# EasyEDA Pro project ProPrj_ESP32SoundBoard_2026-02-01.epro, board ESP32SoundBoard
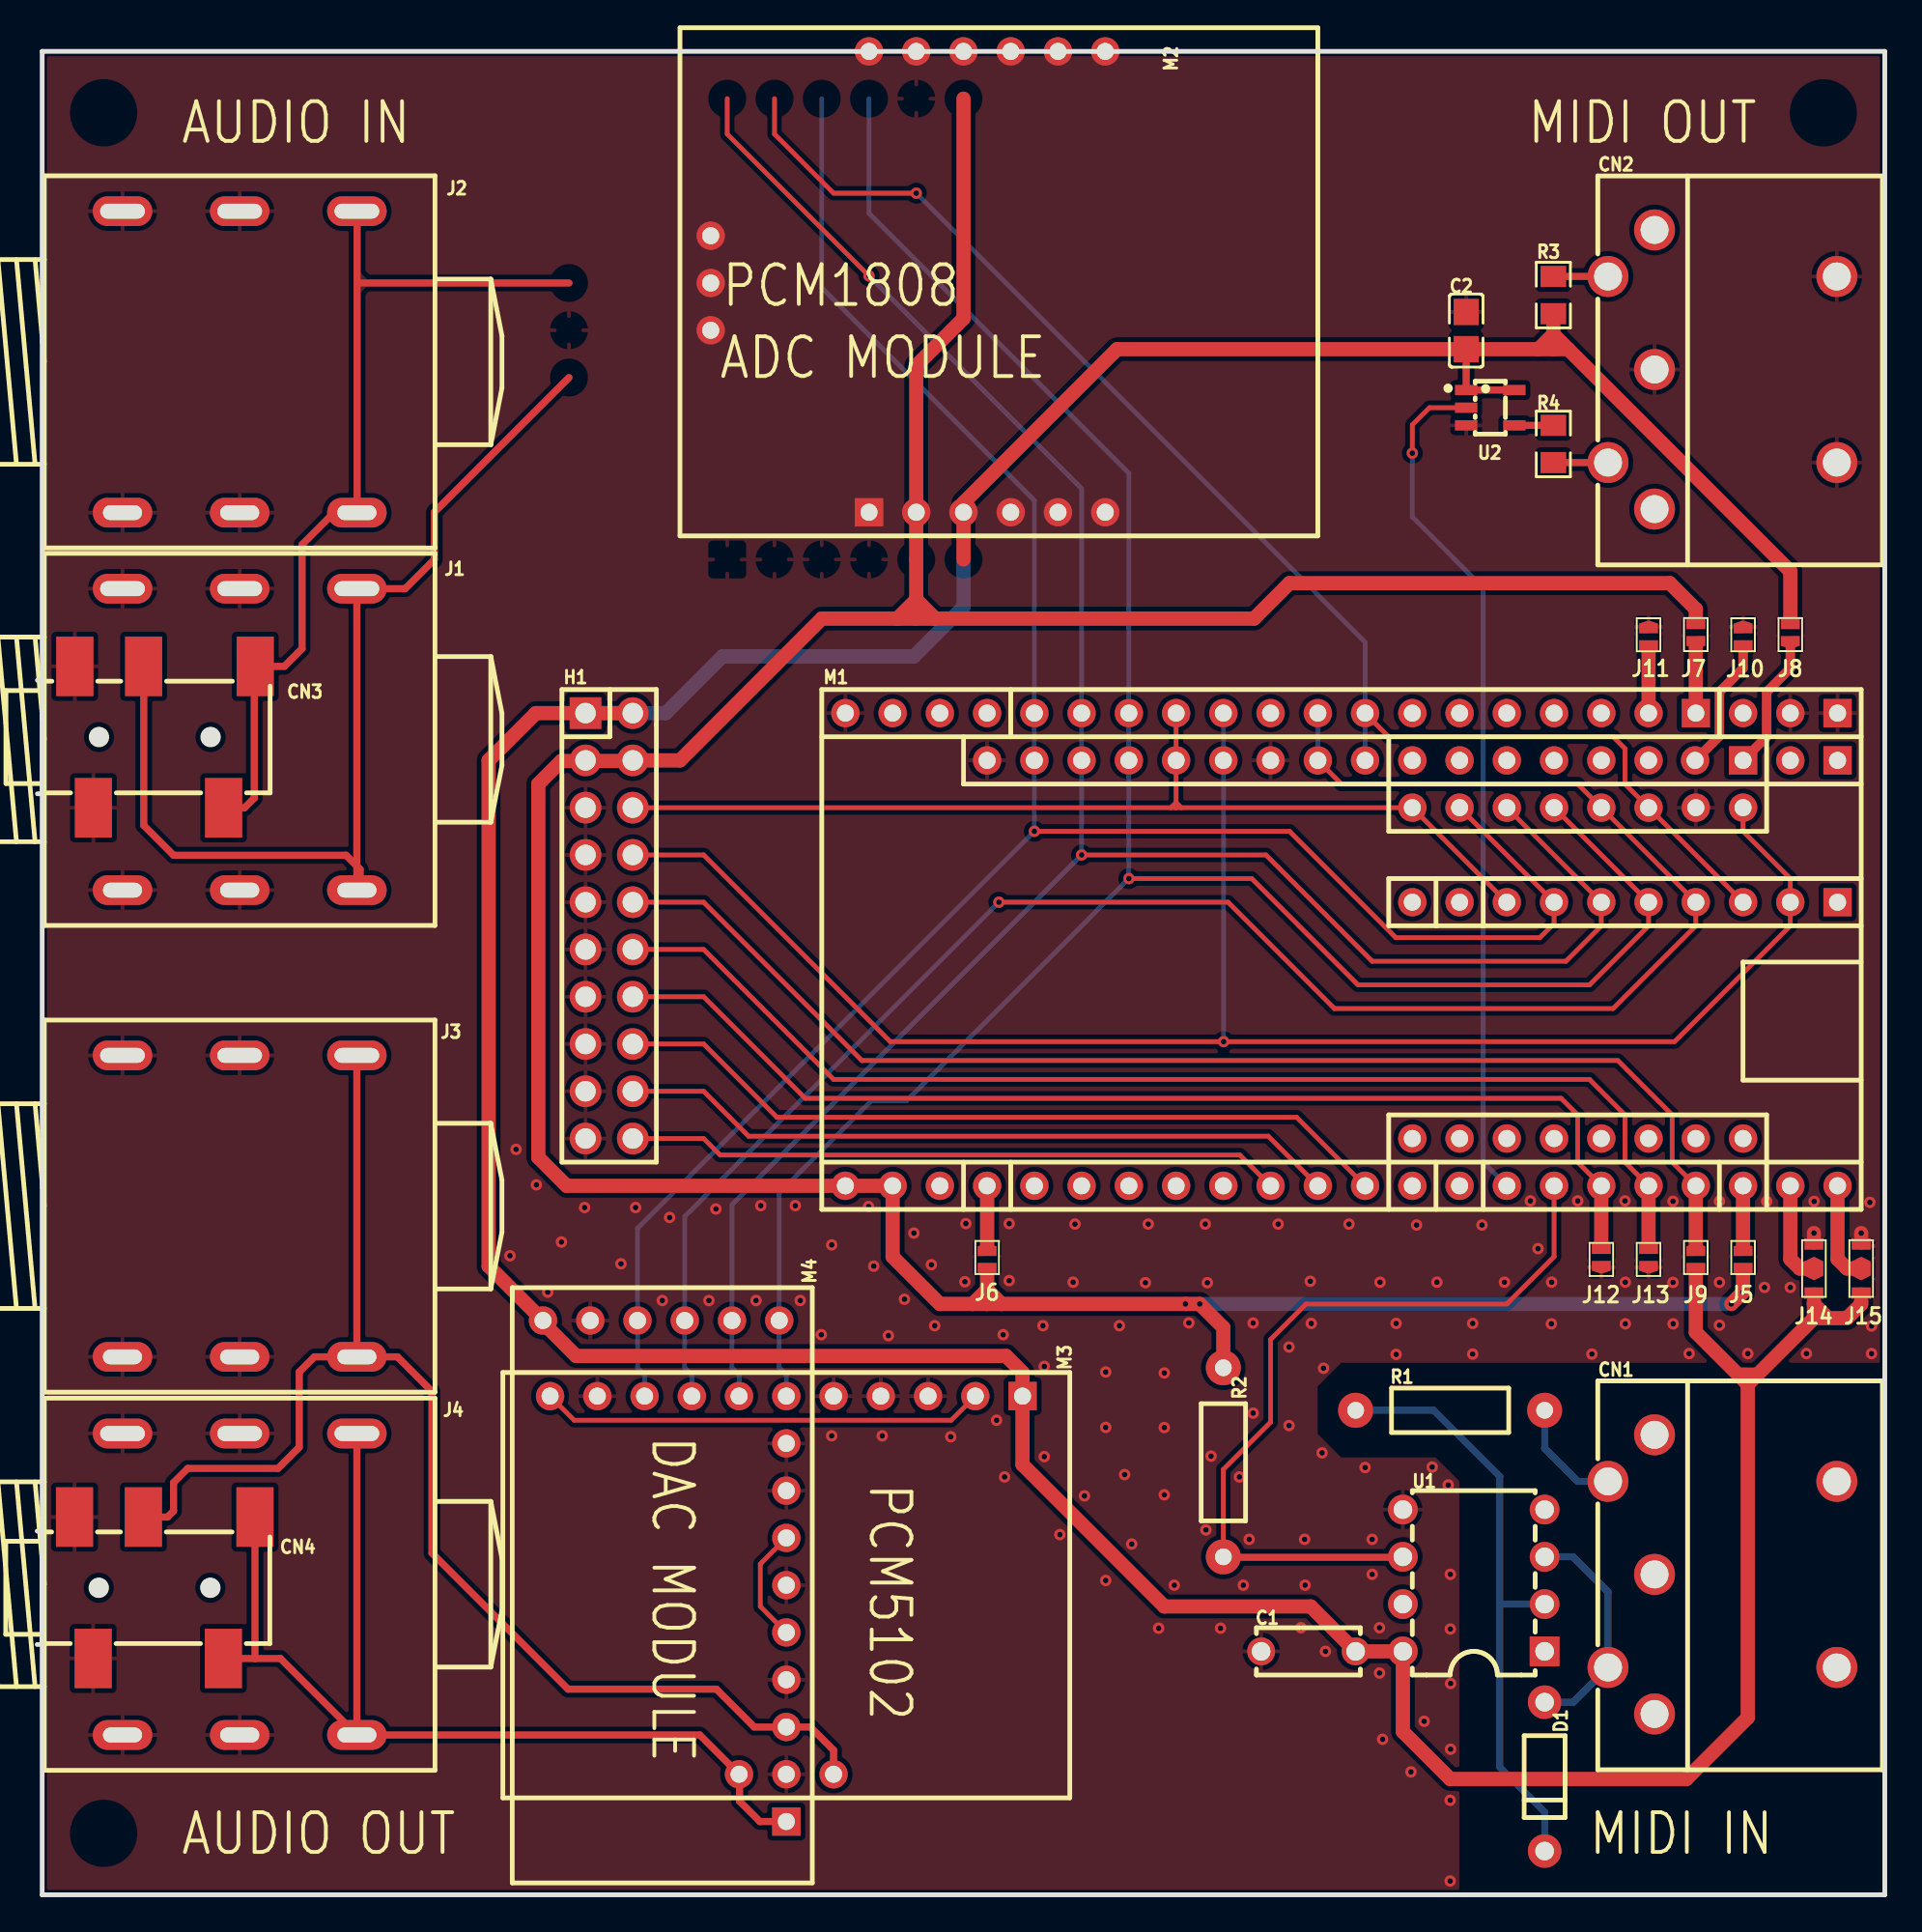
[diagram p4: board, top side]
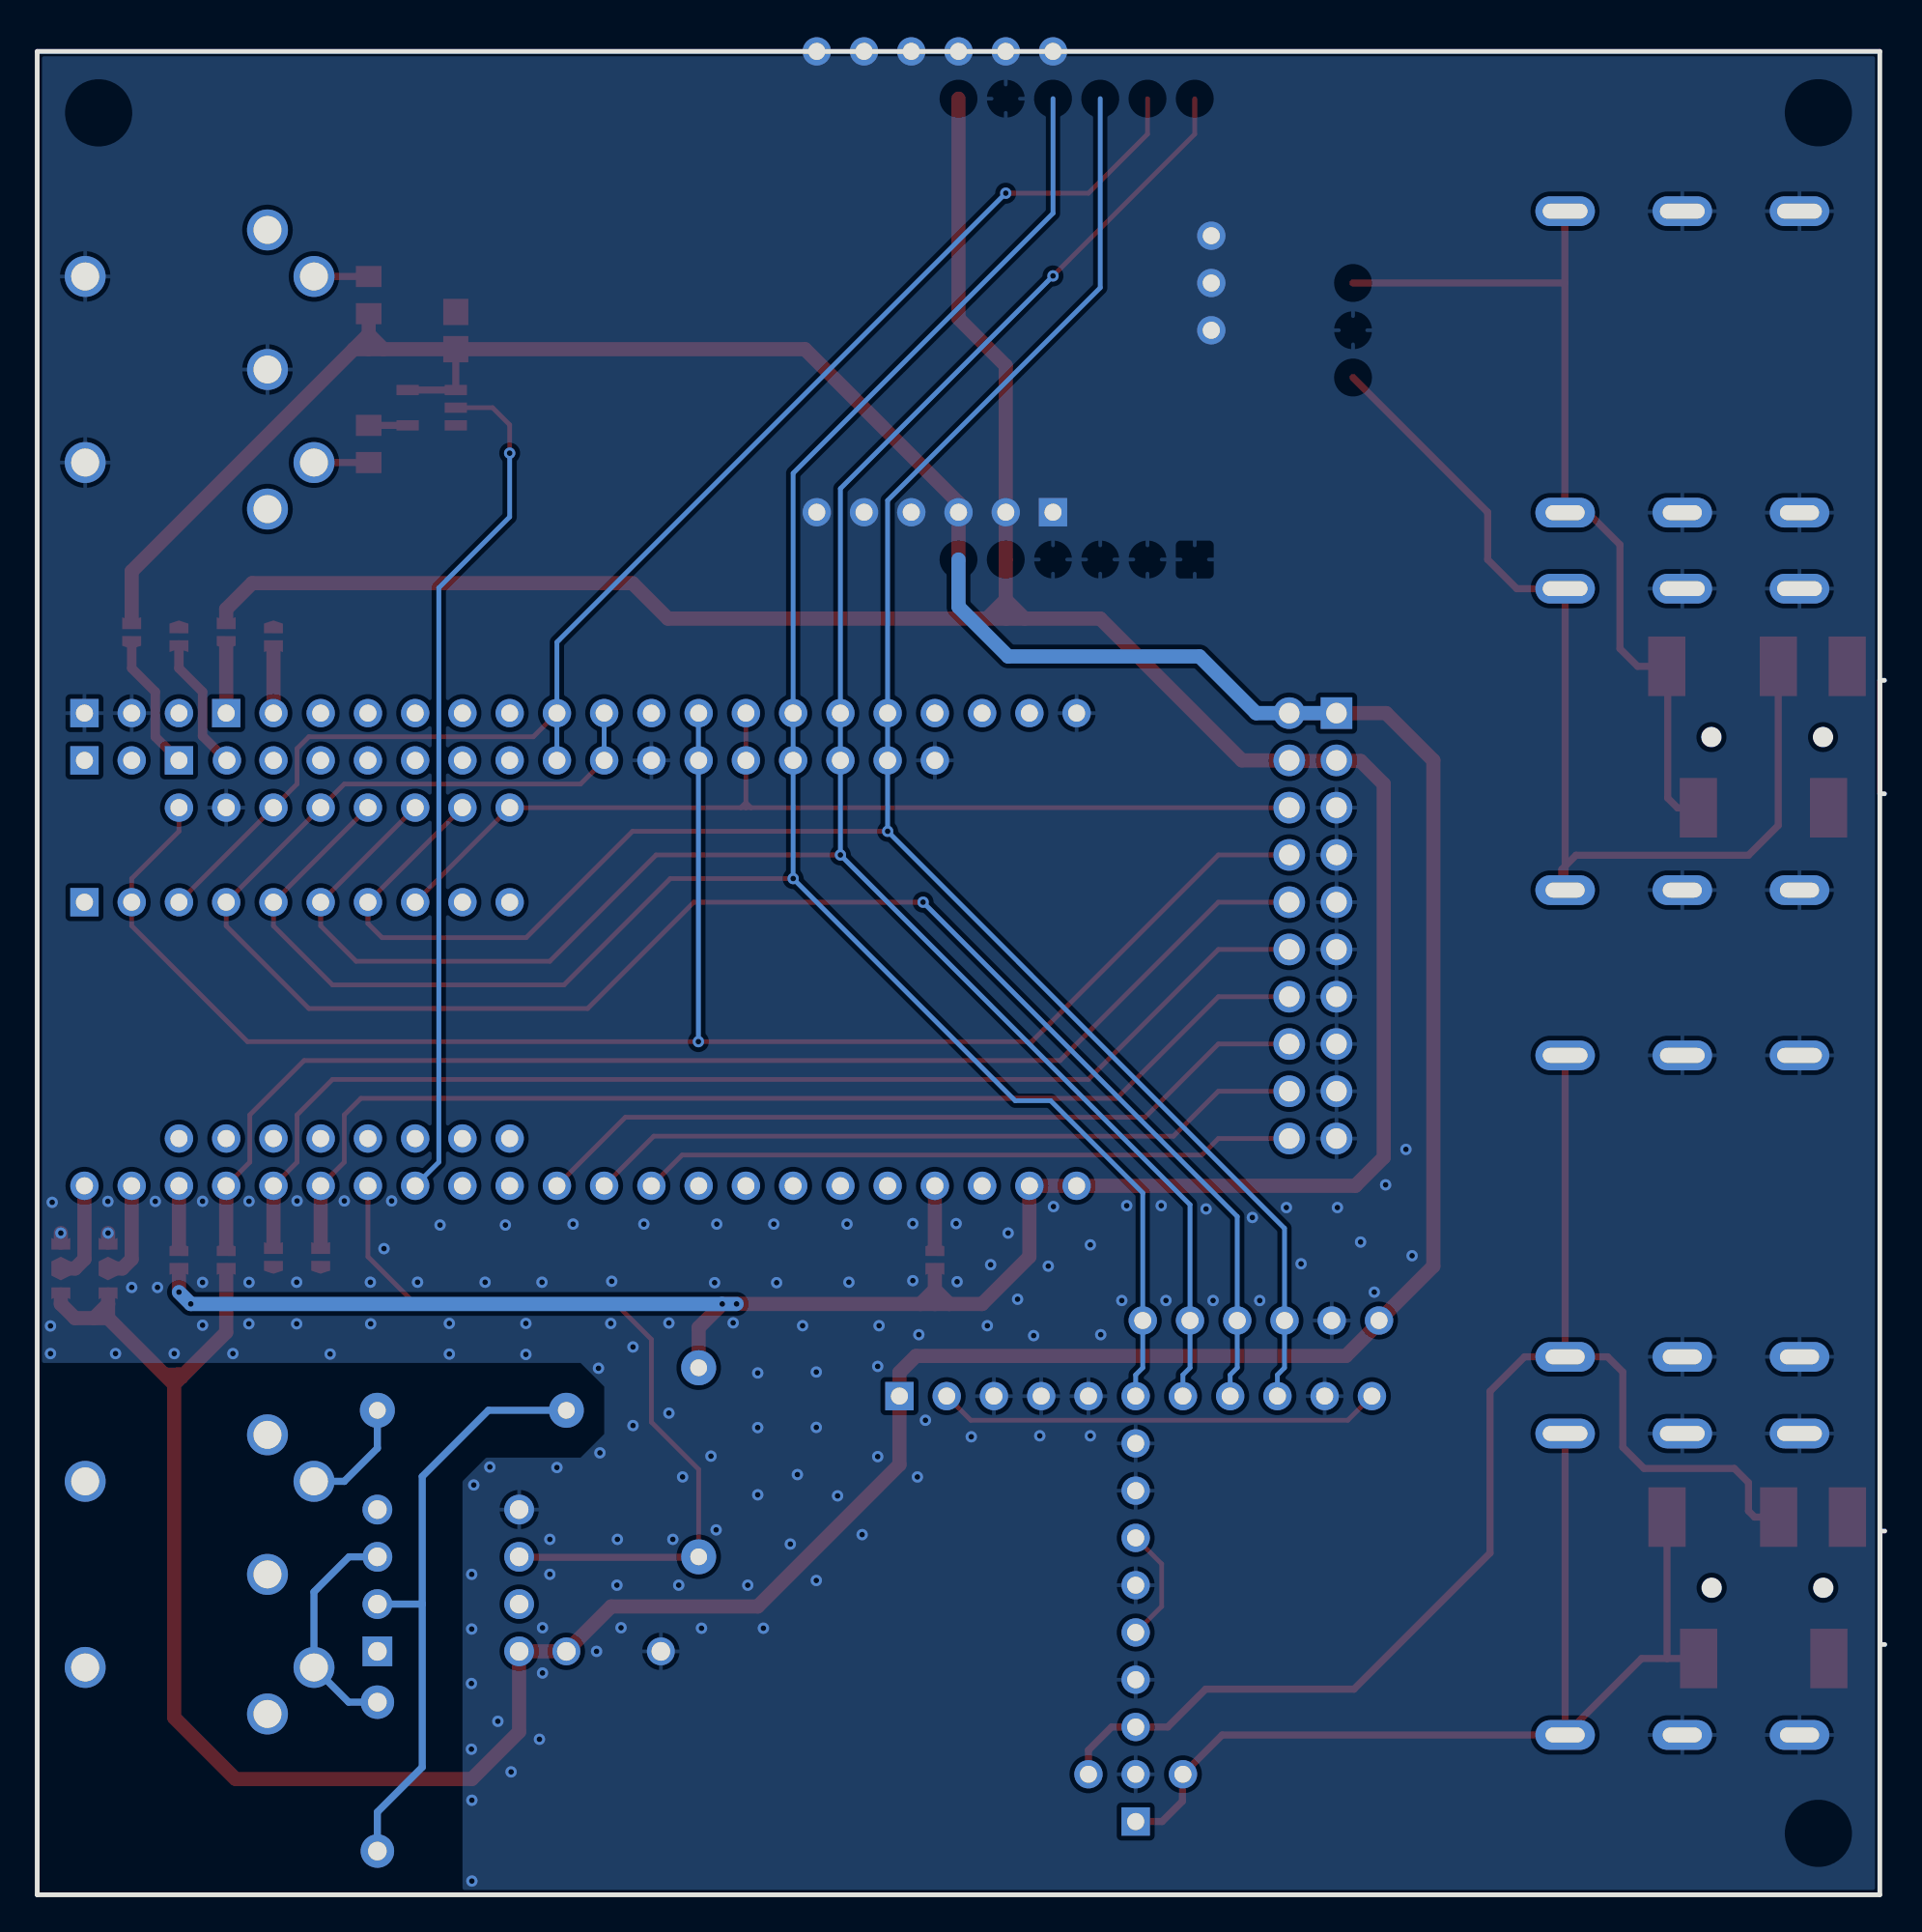
[diagram p5: board, bottom side, seen from below]

Outline 99.33 x 99.06 mm; copper layers: Top Layer, Bottom Layer. Coordinates in mm from the lower left corner of the outline.
Outline path: 0.27,99.06 99.33,99.06 99.33,0 0.27,0 0.27,99.06
Stack: Top Layer 0.035mm / Dielectric1 1.51mm FR4 er 4.5 / Bottom Layer 0.035mm

## Design rules (mm)
template: Custom Config
spacing copperThickness1oz (default): track to track 0.152, other pairs 0.152 to 0.3
spacing copperThickness2oz: track to track 0.203, other pairs 0.152 to 0.3
track width copperThickness1oz (default): min 0.127, default 0.254, max 2.54
track width copperThickness2oz: min 0.203, default 0.254, max 2.54
differential pair differentialPair (default): width min 0.127, default 0.254, max 2.54; gap min 0.152, default 0.152
via viaSize (default): diameter min 0.5, default 0.61, max 10; hole min 0.3, default 0.305, max 6.3

## Placement (name value [footprint] x y rotation side)
C1  100nF  [CAP-TH_L5.5-W2.4-P5.08-D0.6]  68.34 13.08 0 top
C2  100nF  [C0805]  76.82 84.06 90 top
CN1  DIN-504B-M10  [CONN-TH_DIN-504B-M10]  90.6 17.22 90 top
CN2  DIN-504B-M10  [CONN-TH_DIN-504B-M10]  90.6 81.97 90 top
CN3  PJ-327A 5JJ  [AUDIO-SMD_PJ-327A5JJ]  6.87 62.22 90 top
CN4  PJ-327A 5JJ  [AUDIO-SMD_PJ-327A5JJ]  6.86 16.5 90 top
D1  1N4148  [DO-35_BD2.0-L4.0-P8.00-D0.5-FD]  81.04 6.35 270 top
H1  -  [HDR-TH_20P-P2.54-V-M-R2-C10-S2.54]  30.75 52.07 270 top
J1  PJ-609  [AUDIO-TH_PJ-609]  10.89 62.09 0 top
J2  PJ-609  [AUDIO-TH_PJ-609]  10.89 82.37 0 top
J3  PJ-609  [AUDIO-TH_PJ-609]  10.89 37.01 0 top
J4  PJ-609  [AUDIO-TH_PJ-609]  10.89 16.69 0 top
J5  -  [Solder jumper]  91.71 33.7 90 top
J6  -  [Solder jumper]  51.07 33.7 90 top
J7  -  [Solder jumper]  89.17 68.27 270 top
J8  -  [Solder jumper]  94.25 68.27 270 top
J9  -  [Solder jumper]  89.17 33.7 90 top
J10  -  [Solder jumper]  91.71 67.16 90 top
J11  -  [Solder jumper]  86.63 67.16 90 top
J12  -  [Solder jumper]  84.09 34.69 270 top
J13  -  [Solder jumper]  86.63 34.69 270 top
J14  -  [Solder jumper 3 way]  95.52 33.66 90 top
J15  -  [Solder jumper 3 way]  98.06 33.66 90 top
M1  -  [ESP32_DEV_BOARD_MIX]  96.79 63.5 270 top
M2  PCM1808  [PCM1808_ADC_MODULE]  37.1 71.75 90 top
M3  PCM5102  [WCMCU-5102]  52.97 26.8 270 top
M4  PCM5102  [PCM5102_MODULE]  40.27 3.94 180 top
R1  10kΩ  [R_AXIAL-0.4]  75.96 26.03 0 top
R2  10kΩ  [R_AXIAL-0.4]  63.77 23.24 90 top
R3  10kΩ  [R0805]  81.51 85.96 90 top
R4  10kΩ  [R0805]  81.51 77.96 270 top
U1  6N139  [DIP-8_L9.6-W6.4-P2.54-LS7.9-BL]  77.23 16.89 90 top
U2  74LVC1G126GV  [SOT-753_L3.1-W1.7-P0.95-LS3.0-BR]  78.12 79.91 180 top

## Footprints (pads in the part's own frame, mm; a bottom-side part is the same pattern mirrored in y, then rotated)
AUDIO-SMD_PJ-327A5JJ
  rect 3.2x2 smd: 1(3.8,4.85) 2(-3.8,3.85) 3(3.8,1.15) 4(-3.8,-3.15) 5(3.8,-4.85)
AUDIO-TH_PJ-609
  oval 3.2x1.6 hole 2.1x0.8: 2(-6.3,-8.1) 4(0,-8.1) 6(6.3,-8.1)
  oval 3.2x1.6 hole 2.4x0.8: 3(-6.3,8.1) 5(0,8.1) 7(6.3,8.1)
C0805
  rect 1.41x1.35 smd: 1(-1,0) 2(1,0)
CAP-TH_L5.5-W2.4-P5.08-D0.6
  round 1.5 hole 1: 1(-2.54,0) 2(2.54,0)
CONN-TH_DIN-504B-M10
  round 2.2 hole 1.5: 1(-7.5,3.65) 2(-5,6.15) 3(0,3.65) 4(5,6.15) 5(7.5,3.65) 6(-5,-6.15) 7(5,-6.15)
DIP-8_L9.6-W6.4-P2.54-LS7.9-BL
  rect 1.6x1.6 hole 1: 1(-3.81,-3.81)
  round 1.6 hole 1: 2(-1.27,-3.81) 3(1.27,-3.81) 4(3.81,-3.81) 5(3.81,3.81) 6(1.27,3.81) 7(-1.27,3.81) 8(-3.81,3.81)
DO-35_BD2.0-L4.0-P8.00-D0.5-FD
  round 1.8 hole 1: 1(-4,0) 2(4,0)
ESP32_DEV_BOARD_MIX
  rect 1.524x1.524 hole 0.914: 1(0,0) 4(0,-7.62) 45(2.54,0) 47(2.54,-5.08) 72(10.16,0)
  round 1.524 hole 0.914: 2(0,-2.54) 3(0,-5.08) 5(0,-10.16) 6(0,-12.7) 7(0,-15.24) 8(0,-17.78) 9(0,-20.32) 10(0,-22.86) 11(0,-25.4) 12(0,-27.94) 13(0,-30.48) 14(0,-33.02) 15(0,-35.56) 16(0,-38.1) 17(0,-40.64) 18(0,-43.18) 19(0,-45.72) 20(0,-48.26) 21(0,-50.8) 22(0,-53.34) 23(25.4,-53.34) 24(25.4,-50.8) 25(25.4,-48.26) 26(25.4,-45.72) 27(25.4,-43.18) 28(25.4,-40.64) 29(25.4,-38.1) 30(25.4,-35.56) 31(25.4,-33.02) 32(25.4,-30.48) 33(25.4,-27.94) 34(25.4,-25.4) 35(25.4,-22.86) 36(25.4,-20.32) 37(25.4,-17.78) 38(25.4,-15.24) 39(25.4,-12.7) 40(25.4,-10.16) 41(25.4,-7.62) 42(25.4,-5.08) 43(25.4,-2.54) 44(25.4,0) 46(2.54,-2.54) 48(2.54,-7.66) 49(2.54,-10.16) 50(2.54,-12.7) 51(2.54,-15.24) 52(2.54,-17.78) 53(2.54,-20.32) 54(2.54,-22.86) 55(2.54,-25.4) 56(2.54,-27.94) 57(2.54,-30.48) 58(2.54,-33.02) 59(2.54,-35.56) 60(2.54,-38.1) 61(2.54,-40.64) 62(2.54,-43.18) 63(2.54,-45.72) 64(5.08,-5.08) 65(5.08,-7.62) 66(5.08,-10.16) 67(5.08,-12.7) 68(5.08,-15.24) 69(5.08,-17.78) 70(5.08,-20.32) 71(5.08,-22.86) 73(10.16,-2.54) 74(10.16,-5.08) 75(10.16,-7.62) 76(10.16,-10.16) 77(10.16,-12.7) 78(10.16,-15.24) 79(10.16,-17.78) 80(10.16,-20.32) 81(10.16,-22.86) 82(22.86,-22.86) 83(22.86,-20.32) 84(22.86,-17.78) 85(22.86,-15.24) 86(22.86,-12.7) 87(22.86,-10.16) 88(22.86,-7.62) 89(22.86,-5.08)
HDR-TH_20P-P2.54-V-M-R2-C10-S2.54
  rect 1.7x1.7 hole 1.1: 1(-11.43,-1.27)
  round 1.7 hole 1.1: 2(-11.43,1.27) 3(-8.89,-1.27) 4(-8.89,1.27) 5(-6.35,-1.27) 6(-6.35,1.27) 7(-3.81,-1.27) 8(-3.81,1.27) 9(-1.27,-1.27) 10(-1.27,1.27) 11(1.27,-1.27) 12(1.27,1.27) 13(3.81,-1.27) 14(3.81,1.27) 15(6.35,-1.27) 16(6.35,1.27) 17(8.89,-1.27) 18(8.89,1.27) 19(11.43,-1.27) 20(11.43,1.27)
PCM1808_ADC_MODULE
  rect 1.524x1.524 hole 0.914: 1(2.54,-7.62)
  round 1.524 hole 0.914: 2(2.54,-10.16) 3(2.54,-12.7) 4(2.54,-15.24) 5(2.54,-17.78) 6(2.54,-20.32) 7(27.305,-20.32) 8(27.305,-17.78) 9(27.305,-15.24) 10(27.305,-12.7) 11(27.305,-10.16) 12(27.305,-7.62) 13(17.399,0.889) 14(14.859,0.889) 15(12.319,0.889)
PCM5102_MODULE
  rect 1.524x1.524 hole 0.914: 1(0,0)
  round 1.524 hole 0.914: 3(0,-5.08) 4(0,-7.62) 5(0,-10.16) 6(0,-12.7) 7(0,-15.24) 8(0,-17.78) 9(0,-20.32) 10(0.381,-26.924) 11(2.921,-26.924) 12(5.461,-26.924) 13(8.001,-26.924) 14(10.541,-26.924) 15(13.081,-26.924)
R0805
  rect 1.133x1.377 smd: 1(-1,0) 2(1,0)
R_AXIAL-0.4
  round 1.879 hole 0.899: 1(-5.08,0) 2(5.08,0)
Solder jumper
  custom 0.635x1.016 smd: 1(0.021,0)
  custom 0.692x1.016 smd: 2(0.973,0)
Solder jumper 3 way
  custom 0.635x1.016 smd: 1(-1.206,0) 3(1.206,0)
  custom 1.27x1.016 smd: 2(0,0)
SOT-753_L3.1-W1.7-P0.95-LS3.0-BR
  rect 1.199x0.551 smd: 1(1.296,-0.95) 2(1.296,0) 3(1.296,0.95) 4(-1.296,0.95) 5(-1.296,-0.95)
WCMCU-5102
  rect 1.524x1.524 hole 0.914: 1(0,0)
  round 1.524 hole 0.914: 2(0,-2.54) 3(0,-5.08) 4(0,-7.62) 5(0,-10.16) 6(0,-12.7) 7(0,-15.24) 8(0,-17.78) 9(0,-20.32) 10(0,-22.86) 11(0,-25.4) 12(20.32,-15.24) 13(20.32,-12.7) 14(20.32,-10.16)

## Nets
As in the schematic.

Pads without a net: CN1 1 3 5 6 7; CN2 1 5; M1 3 6 7 8 9 10 13 19 20 21 25 27 28 29 30 31 35 36 45 46 49 50 51 52 53 54 72 80 81 82 83 84 85 86 87 88 89; U1 1 4 7

## Via types
v1: diameter 0.61, hole 0.305, Top Layer to Bottom Layer, 142 vias

## Routing (per net, layer and track width the routed paths; a pad name or vN(x,y) marks a point on that pad's centre or on a via; arc(x,y) is an arc through that point)
3V3: length 201.2
  Top Layer w0.762: 47.26,69.6 48.27,68.58 ; 47.26,69.6 47.26,68.61 47.23,68.58 ; 47.26,69.6 46.24,68.58 ; 47.26,69.6 47.26,82.17 49.8,84.71 49.8,96.52 ; 48.27,68.58 65.42,68.58 67.32,70.48 87.77,70.48 89.17,69.09 89.17,68.4 ; 48.27,68.58 47.23,68.58 ; 51.07,31.75 50.29,31.75 ; 51.07,31.75 51.84,31.75 ; 51.07,31.75 51.07,32.52 ; 50.29,31.75 48.53,31.75 45.99,34.29 M1.24 M1.23 28.46,38.1 26.94,39.62 26.94,59.69 28.17,60.93 31.98,60.93 H1.4 34.56,60.96 42.18,68.58 46.24,68.58 ; 50.29,31.75 51.07,32.52 ; 51.07,33.55 51.07,32.52 ; 51.07,32.52 51.84,31.75 ; 47.23,68.58 46.24,68.58 ; 63.77,28.32 63.77,30.48 v1(62.5,31.75) v1(61.73,31.75) 51.84,31.75 ; v1(91.07,31.75) v1(91.71,32.39) 91.71,33.55
  Bottom Layer w0.762: v1(61.73,31.75) v1(62.5,31.75) v1(91.07,31.75) v1(91.71,32.39)
+5V: length 251.6
  Top Layer w0.381: U2.5 U2.1 C2.1
  Top Layer w0.762: 96.28,30.99 97.3,30.99 98.06,31.75 98.06,32.26 ; 96.28,30.99 95.52,31.75 ; 96.28,30.99 95.52,30.99 ; 95.52,31.75 95.52,30.99 ; 95.52,31.75 95.52,32.26 ; 81.51,83.86 80.71,83.06 ; 81.51,83.86 R3.1 ; 81.51,83.86 82.31,83.06 ; 81.51,83.86 81.51,83.08 81.53,83.06 ; 80.71,83.06 81.53,83.06 ; 80.71,83.06 C2.1 58.05,83.06 49.8,74.8 49.8,71.75 ; 91.96,27.43 89.17,30.23 89.17,33.55 ; 91.96,27.43 91.96,9.53 88.66,6.22 75.96,6.22 73.42,8.76 U1.8 C1.2 68.47,15.49 60.59,15.49 52.97,23.11 M3.1 52.97,28.07 52.08,28.96 28.97,28.96 27.19,30.73 27.19,30.86 24.27,33.78 24.27,60.96 26.81,63.5 H1.1 H1.2 ; 91.96,27.43 95.52,30.99 ; 81.53,83.06 82.31,83.06 ; 82.31,83.06 94.25,71.12 94.25,68.4 ; 92.46,27.95 91.47,27.95
  Bottom Layer w0.762: 49.8,71.75 49.8,69.22 47.13,66.55 36.84,66.55 33.8,63.5 H1.2 H1.1
GND: length 1
  Top Layer w0.762: v1(95.52,35.56) 95.52,35.05 ; v1(98.06,35.56) 98.06,35.05
  vias: v1(25.41,34.34) v1(25.74,40.06) v1(26.84,38.15) v1(27.45,32.39) v1(28.18,35.08) v1(29.43,36.93) v1(31.38,33.91) v1(32.17,36.93) v1(33.61,31.94) v1(34,36.4) v1(36.11,31.94) v1(36.49,36.86) v1(38.65,31.94) v1(38.9,37.03) v1(40.76,37.03) v1(41.02,31.94) v1(42.15,30.1) v1(42.71,34.92) v1(42.71,24.66) v1(44.69,36.98) v1(44.97,33.78) v1(45.43,24.66) v1(45.76,30.05) v1(46.62,32) v1(47.13,35.56) v1(48.07,33.86) v1(48.25,30.58) v1(49.11,24.61) v1(49.87,32.94) v1(49.93,36.07) v1(51.58,25.5) v1(51.93,30.1) v1(52.01,22.45) v1(52.25,36.07) v1(52.25,33) v1(54.07,30.58) v1(54.14,28.4) v1(54.14,23.55) v1(54.98,19.35) v1(55.69,32.92) v1(55.79,36.04) v1(56.3,21.44) v1(57.44,28.09) v1(57.44,25.12) v1(57.44,16.89) v1(58.18,30.58) v1(58.46,22.58) v1(58.84,18.85) v1(59.58,32.89) v1(59.73,36.04) v1(60.29,14.33) v1(60.59,28.04) v1(60.59,25.11) v1(60.59,21.49) v1(61.13,16.64) v1(61.91,30.73) v1(62.79,36.04) v1(62.91,32.89) v1(62.83,19.61) v1(63.11,23.57) v1(63.62,14.33) v1(64.63,22.45) v1(64.84,16.64) v1(65.16,19.1) v1(65.37,30.72) v1(65.37,25.88) v1(66.71,36.04) v1(67.3,29.44) v1(67.3,25.22) v1(67.94,14.35) v1(68.14,19.1) v1(68.16,16.64) v1(68.44,32.97) v1(68.49,30.7) v1(69.08,23.75) v1(69.15,28.3) v1(69.26,13.08) v1(70.52,36.04) v1(71.39,22.96) v1(71.77,19.1) v1(71.77,17.22) v1(72.19,32.92) v1(72.16,14.35) v1(72.16,11.92) v1(72.33,8.36) v1(73.06,30.7) v1(73.06,29.04) v1(73.85,6.6) v1(74.16,35.99) v1(74.56,9.32) v1(75,22.99) v1(75.25,32.92) v1(75.86,22.02) v1(75.97,17.22) v1(75.97,14.28) v1(75.99,11.35) v1(75.99,7.82) v1(75.96,5.08) v1(75.96,0.74) v1(77.17,30.7) v1(77.17,29.06) v1(77.67,35.99) v1(78.88,32.92) v1(80.27,37.29) v1(80.68,34.72) v1(81.42,32.92) v1(81.4,30.68) v1(82.82,37.29) v1(83.58,29.06) v1(85.36,37.29) v1(85.38,32.92) v1(85.38,30.68) v1(87.94,37.27) v1(87.94,32.91) v1(87.95,30.68) v1(88.81,29.08) v1(90.44,37.27) v1(90.44,32.91) v1(90.44,30.61) v1(91.96,29.08) v1(92.86,32.64) v1(92.98,37.26) v1(94.25,32.64) v1(95.12,29.08) v1(95.53,37.26) v1(98.52,37.21) v1(98.62,30.57) v1(98.62,29.08)
AOL: length 58.5
  Top Layer w0.381: 11.7,12.7 CN4.4 ; 11.7,12.7 11.71,12.7 CN4.5 ; 11.7,12.7 13.08,12.7 J4.6 ; J4.6 35.62,8.59 M3.12 37.76,6.45 37.76,5.03 38.85,3.94 M4.1 ; J4.6 J4.7
AOR: length 75.3
  Top Layer w0.381: J3.6 J3.7 ; J3.6 19.37,28.91 21.22,27.05 21.22,18.36 28.54,11.05 36.51,11.05 38.55,9.02 41.57,9.02 42.81,7.77 42.81,6.48 ; J3.6 14.9,28.91 14.09,28.09 14.09,24.05 12.94,22.91 8.09,22.91 7.33,22.15 7.33,20.62 7,20.3 CN4.3
I2C1_SCL: length 64.6
  Top Layer w0.254: M1.40 85.36,39.37 85.36,41.91 83.45,43.81 42.81,43.81 35.83,50.8 H1.12
  Top Layer w0.762: M1.40 86.63,34.82
I2C1_SDA: length 61
  Top Layer w0.254: H1.14 35.83,48.26 41.29,42.8 81.93,42.8 82.82,41.91 82.82,39.37 M1.39
  Top Layer w0.762: M1.39 84.09,34.82
I2C2_SCL: length 38.9
  Top Layer w0.254: H1.18 35.83,43.18 38.24,40.77 66.18,40.77 M1.33
I2C2_SDA: length 35.3
  Top Layer w0.254: H1.20 35.83,40.64 36.72,39.75 64.66,39.75 M1.32
I2S_BCLK: length 125.1
  Top Layer w0.254: M1.69 M1.77 84.09,52.07 82.18,50.17 71.77,50.17 66.05,55.88 v1(56.15,55.88) ; v1(44.72,87) 37.1,94.62 37.1,96.52
  Bottom Layer w0.254: v1(44.72,87) 56.15,75.56 M1.17 M1.61 v1(56.15,55.88) 37.35,37.08 37.35,28.32 37.73,27.94 M3.7
I2S_LRCK: length 122.4
  Top Layer w0.254: v1(53.61,57.15) 67.32,57.15 73.04,51.44 80.79,51.44 81.55,52.2 M1.78 M1.70
  Bottom Layer w0.254: 32.65,26.8 32.65,27.94 32.27,28.32 32.27,35.81 v1(53.61,57.15) M1.62 M1.18 53.61,74.93 42.18,86.36 42.18,96.52
I2S_MCLK: length 124.6
  Top Layer w0.254: v1(58.69,54.61) 65.29,54.61 71.01,48.89 83.45,48.89 86.63,52.07 M1.76 M1.68
  Bottom Layer w0.254: 40.27,26.8 40.27,27.94 39.89,28.32 39.89,37.72 44.84,42.67 46.75,42.67 v1(58.69,54.61) M1.60 M1.16 58.69,76.39 44.72,90.36 44.72,96.52
I2S_SDI: length 77
  Top Layer w0.254: 39.64,96.52 39.64,94.62 42.81,91.44 v1(47.26,91.44) ; M1.11 72.66,62.23 84.72,62.23 85.36,61.59 85.36,59.69 M1.66 M1.74
  Bottom Layer w0.254: M1.55 M1.11 71.39,67.31 v1(47.26,91.44)
I2S_SDO: length 102.7
  Top Layer w0.254: M1.56 70.12,59.69 82.82,59.69 M1.67 M1.75 89.17,52.07 84.72,47.62 69.74,47.62 64.02,53.34 v1(51.7,53.34)
  Bottom Layer w0.254: M3.8 35.19,27.94 34.81,28.32 34.81,36.45 v1(51.7,53.34) ; M1.56 M1.12
INT1: length 68.2
  Top Layer w0.254: M1.41 87.9,39.37 87.9,41.91 84.98,44.83 44.34,44.83 35.83,53.34 H1.10
  Top Layer w0.762: M1.41 89.17,34.82
INT2: length 42.5
  Top Layer w0.254: H1.16 35.83,45.72 39.77,41.78 67.71,41.78 M1.34
MIDI_RX: length 43.3
  Top Layer w0.254: R2.1 63.77,22.86 66.31,25.4 66.31,29.84 68.21,31.75 79.01,31.75 81.55,34.29 M1.38
  Top Layer w0.381: U1.6 73.39,18.13 63.74,18.13
MIDI_TX: length 46.3
  Top Layer w0.254: U2.2 74.85,79.91 73.93,78.99 v1(73.93,77.47)
  Bottom Layer w0.254: v1(73.93,77.47) 73.93,74.04 77.74,70.23 77.74,39.37 M1.37
SPARE1: length 55
  Top Layer w0.254: M1.79 M1.71 61.5,58.42 ; 60.95,58.42 H1.6 ; 60.95,58.42 61.23,58.7 ; 60.95,58.42 61.22,58.42 ; 61.5,58.42 61.22,58.42 ; 61.5,58.42 61.23,58.7 ; 61.23,58.7 61.23,58.42 61.22,58.42 ; 61.23,58.7 M1.59 M1.15
SPARE2: length 94
  Top Layer w0.254: M1.64 91.71,57.15 94.25,54.61 M1.73 94.25,52.07 88.03,45.85 v1(63.78,45.85) 45.86,45.85 35.83,55.88 H1.8
  Bottom Layer w0.254: M1.14 63.78,63.49 v1(63.78,45.85)
$1N8448: length 32.8
  Bottom Layer w0.381: 78.63,15.62 78.63,6.86 81.04,4.44 D1.2 ; 78.63,15.62 78.63,15.62 U1.2 ; 78.63,15.62 78.63,22.48 75.07,26.03 R1.1
$1N8617: length 2.1
  Top Layer w0.381: U2.4 R4.1
$1N9304: length 6.2
  Bottom Layer w0.381: CN1.4 82.82,22.22 81.04,24 R1.2
$1N9313: length 12.4
  Bottom Layer w0.381: U1.3 82.56,18.16 84.45,16.28 CN1.2 82.58,10.35 D1.1
$1N9335: length 2.9
  Top Layer w0.381: CN2.4 81.51,86.97
$1N9340: length 2.9
  Top Layer w0.381: CN2.2 81.51,76.97
$1N10058: length 23.9
  Top Layer w0.254: 50.43,26.8 49.14,25.5 28.87,25.5 M3.11
$1N10064: length 6.2
  Top Layer w0.254: 40.27,19.18 38.88,17.78 38.88,15.49 M4.5
$1N10608: length 56.1
  Top Layer w0.381: 17.18,55.28 17.18,70.19 ; 17.18,55.28 16.6,55.87 7.33,55.87 5.73,57.46 5.73,66.01 CN3.3 ; 17.18,55.28 17.18,53.99 17.36,54.17 17.36,55.1 17.18,55.28 ; J1.7 19.78,70.19 21.35,71.75 21.35,74.3 28.59,81.53
$1N10635: length 49.6
  Top Layer w0.381: 17.2,86.61 17.2,74.27 ; 17.2,86.61 17.2,90.47 ; 17.2,86.61 28.59,86.61 ; 17.2,74.27 17.96,74.27 ; 17.2,74.27 15.96,74.27 14.24,72.55 14.24,66.97 13.29,66.02 11.67,66.02 11.67,58.94 11.14,58.41 9.98,58.41 9.97,58.42
$1N57894: length 3.7
  Top Layer w0.762: M1.4 89.17,67.18
$1N57899: length 3.3
  Top Layer w0.762: M1.26 51.07,34.8
$1N57905: length 3.3
  Top Layer w0.762: M1.42 91.71,34.82
$1N58212: length 7.4
  Top Layer w0.508: M1.47 92.98,62.23 92.98,64.64 94.25,65.91 J8.2
$1N58220: length 5.4
  Top Layer w0.762: J15.2 97.3,33.66 96.79,34.16 M1.44
$1N58226: length 5.4
  Top Layer w0.762: M1.43 94.25,34.16 94.76,33.66 J14.2
$1N59131: length 3.5
  Top Layer w0.762: M1.5 86.63,67
$1N59137: length 7.3
  Top Layer w0.508: 91.71,67.16 91.71,65.91 90.44,64.64 90.44,62.27 M1.48

## Copper pours and planes (outline as drawn; the poured copper is in the pictures)
GND on Top Layer: 0.27,99.06 99.33,99.06 99.33,0 0.27,0
GND on Bottom Layer: 0.27,99.06 99.33,99.06 99.33,0 0.27,0
$1N10635 on Top Layer: 17.2,87.35 17.92,87.35 17.92,85.91 17.2,85.91

## Text on the board
Top Silkscreen Layer: AUDIO IN | AUDIO OUT | ADC MODULE | PCM1808 | MIDI OUT | MIDI IN | DAC MODULE | PCM5102
